# Altium project LightOnOff.PrjPcb
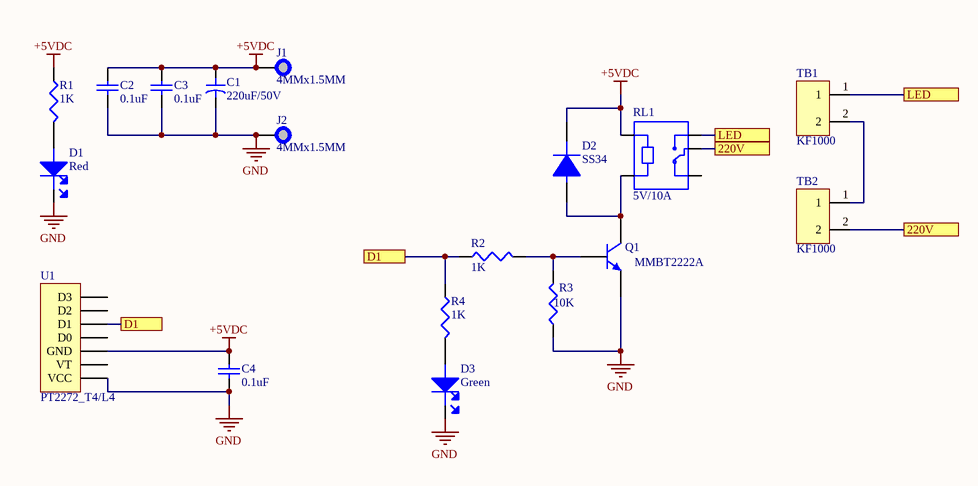
[diagram p0: LightOnOff.SchDoc]
1 sheet, 18 parts. Net scope: flat (ports and power ports of the same name join across sheets).
Board file: LightOnOff.PcbDoc

## Sheet LightOnOff.SchDoc
size A4

### Parts
C1  220uF/50V  [CAP_RADIAL_8MM]
C2  0.1uF  [C0805]
C3  0.1uF  [C0805]
C4  0.1uF  [C0805]
D1  Red  [LED_RED_0805]
D2  SS34  [DO14AC SMA]
D3  Green  [LED_GREEN_0805]
J1  4MMx1.5MM  [PAD_WITH_HOLE_4MMx1.5MM]  (no BOM)
J2  4MMx1.5MM  [PAD_WITH_HOLE_4MMx1.5MM]  (no BOM)
Q1  MMBT2222A  [SOT_23]
R1  1K  [R0805]
R2  1K  [R0805]
R3  10K  [R0805]
R4  1K  [R0805]
RL1  5V/10A  [Relay_SRD]
TB1  KF1000  [KF1000_2P]
TB2  KF1000  [KF1000_2P]
U1  PT2272_T4/L4  [PT2272_T4/L4]

### Ports
220V, D1, LED

### Nets
+5VDC: C1.1 C2.2 C3.2 C4.2 D2.2(Cathode) J1.1 R1.1 RL1.A1 U1.5(GND)
GND: C1.2 C2.1 C3.1 C4.1 D1.2(Cathode) D3.2(Cathode) J2.1 Q1.3(E) R3.1 U1.7(VCC)
NetD1_1: D1.1(Anode) R1.2
NetD2_1: D2.1(Anode) Q1.2(C) RL1.A2
NetD3_1: D3.1(Anode) R4.2
NetQ1_1: Q1.1(B) R2.2 R3.2
NetR2_1: R2.1 R4.1 U1.3(D1) ; port D1
NetRL1_COM: RL1.COM TB2.2 ; port 220V
NetRL1_NO: RL1.NO TB1.1 ; port LED
NetTB1_2: TB1.2 TB2.1

Not connected (* = marked no-connect by the designer): RL1 NC; U1 1(D3) 2(D2) 4(D0) 6(VT)

### Library data of the parts
C1 = C220uF_RADIAL_50V_8MM: ALUMINUM ELECTROLYTIC CAPACITOR, 220UF, 35V, 20%, RADIAL; Product Range:FM Series; Capacitance:220 F; Capacitance Tolerance: 20%; Voltage Rating:35V; Diameter:8mm; Capacitor Terminals:Radial Leaded; Packaging:Each; ESR:- ;RoHS Compliant: Yes; Manufacturer: Panasonic; Manufacturer Part Number: EEUFM1V221L; Dielectric Material: Aluminium; Ripple Current: 1.24A; Impedance: 41mR; Life (Hours): 3000Hour; Dissipation Factor: 0.12%; Lead Diameter: 0.6mm; Lead Length: 17mm; Supplier 1: Digi-Key; Stock 1: 22801; Pricing 1: 1=0.45000, 10=0.32100, 100=0.21170, 500=0.15680, 1000=0.13328, 2500=0.12544, 5000=0.11760 (USD); RoHS: Yes; Mount: Through Hole,PCB; Case/Package: Radial; Number of Pins: 2; Min Operating Temperature: -40°C; Max Operating Temperature: 105°C; Capacitance: 220uF; Tolerance: 20%; Termination: Radial; Packaging: Bulk; Package Quantity: 200; Voltage Rating (DC): 35V; Voltage Rating: 35V; ESR (Equivalent Series Resistance): 41mR; Voltage: 35V; Diameter: 8mm; Length: 15mm; Height: 15mm; Lead Pitch: 3.5mm; Height - Seated (Max): 0.65inch; Radiation Hardening: No; Lead Free: Lead Free; REACH SVHC: Yes; ComponentLink1URL: https://datasheet.ciiva.com/11782/0900766b805f3abe-11782034.pdf?src-supplier=RSComponents; ComponentLink1Description: https://datasheet.ciiva.com/11782/0900766b805f3abe-11782034.pdf?src-supplier=RSComponents; ComponentLink2URL: https://datasheet.ciiva.com/27052/1362169-27052083.pdf?src-supplier=Jameco; ComponentLink2Description: https://datasheet.ciiva.com/27052/1362169-27052083.pdf?src-supplier=Jameco; ComponentLink3URL: https://datasheet.ciiva.com/16432/aba0000ce108-16432952.pdf?src-supplier=Future+Electronics; ComponentLink3Description: https://datasheet.ciiva.com/16432/aba0000ce108-16432952.pdf?src-supplier=Future+Electronics; ComponentLink4URL: https://datasheet.ciiva.com/24025/a-e-461514-24025544.pdf?src-supplier=Mouser; ComponentLink4Description: https://datasheet.ciiva.com/24025/a-e-461514-24025544.pdf?src-supplier=Mouser; ComponentLink5URL: https://datasheet.ciiva.com/2984/aba0000ce108-2984074.pdf?src-supplier=Avnet; ComponentLink5Description: https://datasheet.ciiva.com/2984/aba0000ce108-2984074.pdf?src-supplier=Avnet; ComponentLink6URL: https://datasheet.ciiva.com/43454/1678946-43454650.pdf?src-supplier=Farnell; ComponentLink6Description: https://datasheet.ciiva.com/43454/1678946-43454650.pdf?src-supplier=Farnell; ComponentLink7URL: https://datasheet.ciiva.com/14594/70068540-14594187.pdf?src-supplier=Allied+Electronics; ComponentLink7Description: https://datasheet.ciiva.com/14594/70068540-14594187.pdf?src-supplier=Allied+Electronics; ComponentLink8URL: https://datasheet.ciiva.com/30085/aba0000ce108-30085595.pdf?src-supplier=Onlinecomponents.com; ComponentLink8Description: https://datasheet.ciiva.com/30085/aba0000ce108-30085595.pdf?src-supplier=Onlinecomponents.com; ComponentLink9URL: https://datasheet.ciiva.com/46396/1678946-46396779.pdf?src-supplier=Element14; ComponentLink9Description: https://datasheet.ciiva.com/46396/1678946-46396779.pdf?src-supplier=Element14; ComponentLink10URL: https://datasheet.ciiva.com/14586/70068540-14586860.pdf?src-supplier=Allied+Electronics; ComponentLink10Description: https://datasheet.ciiva.com/14586/70068540-14586860.pdf?src-supplier=Allied+Electronics; Supplier Part Number 1: P12412-ND
C2-C4 = C0.1uF_0805: KEMET         C0805C104Z5VACTU.             CERAMIC CAPACITOR, 0.1UF, 50V, Y5V, +80,-20%, 0805; Capacitance: 100nF; Tolerance: 80%; Dissipation Factor: 5%; Supplier 1: Digi-Key; Manufacturer: KEMET; Manufacturer Part Number: C0805C104Z5VACTU; Stock 1: 1249727; Pricing 1: 1 = 0.10000, 10 = 0.05700, 100 = 0.02540, 500 = 0.01818, 1000 = 0.01428 (USD); RoHS: Yes; Mount: Surface Mount,PCB; Case/Package: 0805; Number of Pins: 2; Case Code (Metric): 2012; Case Code (Imperial): 0805; Dielectric Material: Ceramic; Min Operating Temperature: -30°C; Max Operating Temperature: 85°C; Package Quantity: 1; Voltage Rating: 50V; Packaging: Tape and Reel; Voltage Rating (DC): 50V; Dielectric: Y5V; Termination: SMD/SMT; Voltage: 50V; Length: 2mm; Height: 0.9mm; Width: 0.049inch; Thickness: 0.039inch; Lead Pitch: 0.75mm; Depth: 1.25mm; Radiation Hardening: No; REACH SVHC: No SVHC; Lead Free: Lead Free; ComponentLink1URL: https://datasheet.ciiva.com/14597/70095383-14597846.pdf?src-supplier=Allied+Electronics; ComponentLink1Description: https://datasheet.ciiva.com/14597/70095383-14597846.pdf?src-supplier=Allied+Electronics; ComponentLink2URL: https://datasheet.ciiva.com/18219/getdatasheetpartid-37101-18219255.pdf?src-supplier=Verical; ComponentLink2Description: https://datasheet.ciiva.com/18219/getdatasheetpartid-37101-18219255.pdf?src-supplier=Verical; ComponentLink3URL: https://datasheet.ciiva.com/26847/getdatasheetpartid-321176-26847799.pdf?src-supplier=Verical; ComponentLink3Description: https://datasheet.ciiva.com/26847/getdatasheetpartid-321176-26847799.pdf?src-supplier=Verical; ComponentLink4URL: https://datasheet.ciiva.com/14608/70095383-14608251.pdf?src-supplier=Allied+Electronics; ComponentLink4Description: https://datasheet.ciiva.com/14608/70095383-14608251.pdf?src-supplier=Allied+Electronics; ComponentLink5URL: https://datasheet.ciiva.com/7842/1470417-7842543.pdf?src-supplier=Element14; ComponentLink5Description: https://datasheet.ciiva.com/7842/1470417-7842543.pdf?src-supplier=Element14; Supplier Part Number 1: 399-1177-1-ND
D1 = LED_RED_0805: LED RED DIFFUSED 0805 SMD; Manufacturer: Osram Opto; Manufacturer Part Number: LHR974-LP-1; Forward Voltage: 2.6V; Lens Style: Diffused,Colorless; Luminous Intensity: 15mcd; Viewing Angle: 160°; Forward Current: 30mA; Dominant Wavelength: 645nm; Number of Elements: 1; Test Current: 20mA; Reverse Voltage: 5V; Supplier 1: Digi-Key; Supplier Part Number 1: 475-1415-1-ND; Stock 1: 73137; Pricing 1: 1 = 0.27000, 10 = 0.20100, 100 = 0.09510, 500 = 0.06340, 1000 = 0.04966 (USD); RoHS: Yes; Mount: Surface Mount; Number of Pins: 2; Min Operating Temperature: -30°C; Max Operating Temperature: 85°C; Packaging: Tape and Reel; Length: 2.1mm; Depth: 1.35mm; Radiation Hardening: No; ComponentLink1URL: http://www.jameco.com/Jameco/Products/ProdDS/2085634.pdf?src-supplier=Jameco; ComponentLink1Description: http://www.jameco.com/Jameco/Products/ProdDS/2085634.pdf?src-supplier=Jameco; ComponentLink2URL: http://components.arrow.com/part/dataview/0323_01825492?src-supplier=Arrow+Europe; ComponentLink2Description: http://components.arrow.com/part/dataview/0323_01825492?src-supplier=Arrow+Europe; ComponentLink3URL: http://components.arrow.com/part/dataview/41971690S1077610N9133?src-supplier=Arrow; ComponentLink3Description: http://components.arrow.com/part/dataview/41971690S1077610N9133?src-supplier=Arrow; ComponentLink4URL: https://dammedia.osram.info/media/resource/hires/osram-dam-2493888/LH%20R974.pdf?src-supplier=Digi-Key; ComponentLink4Description: https://dammedia.osram.info/media/resource/hires/osram-dam-2493888/LH%20R974.pdf?src-supplier=Digi-Key; ComponentLink5URL: http://components.arrow.com/part/dataview/41971690S6190115N2128?src-supplier=Arrow; ComponentLink5Description: http://components.arrow.com/part/dataview/41971690S6190115N2128?src-supplier=Arrow; ComponentLink6URL: http://www.mouser.com/ds/2/311/LH%20R974%20-%20CHIPLED%200805-318659.pdf?src-supplier=Mouser; ComponentLink6Description: http://www.mouser.com/ds/2/311/LH%20R974%20-%20CHIPLED%200805-318659.pdf?src-supplier=Mouser; ComponentLink7URL: https://www.verical.com/server-webapp/html/getDatasheet?partID=258950&src-supplier=Verical; ComponentLink7Description: https://www.verical.com/server-webapp/html/getDatasheet?partID=258950&src-supplier=Verical
D2 = SS34_DO214AC
D3 = LED_GREEN_0805: Green 0805 130 º Min 5 mcd Typical 12 mcd Water Clear Lens SMT LED; Manufacturer: Vishay Lite-On; Manufacturer Part Number: LTST-C171GKT; Lens Color: Colorless; Viewing Angle: 130°; Lens Style: Diffused,Colorless,Rectangular,Clear; Luminous Intensity: 12mcd; Forward Current: 30mA; Forward Voltage: 2.1V; Power Rating: 100mW; Dominant Wavelength: 569nm; Test Current: 10mA; Number of Elements: 1; Wavelength: 585nm; Reverse Voltage: 5V; Supplier 1: Digi-Key; Supplier Part Number 1: 160-1423-1-ND; Stock 1: 284618; Pricing 1: 1 = 0.28000, 10 = 0.20100, 100 = 0.09540, 500 = 0.06364, 1000 = 0.04984 (USD); RoHS: Yes; Mount: Surface Mount; Case/Package: 0805; Number of Pins: 2; Color: Green; Case Code (Metric): 2012; Case Code (Imperial): 0805; Min Operating Temperature: -55°C; Max Operating Temperature: 85°C; Package Quantity: 1; Packaging: Tape and Reel; Illumination Color: Green; Lens Transparency: Clear; Power Dissipation: 100mW; Number of LEDs: 1; Length: 2mm; Height: 0.8mm; Width: 1.25mm; Depth: 1.25mm; Radiation Hardening: No; Lead Free: Lead Free; ComponentLink1URL: https://datasheet.ciiva.com/11773/0900766b80dc0296-11773991.pdf?src-supplier=RSComponents; ComponentLink1Description: https://datasheet.ciiva.com/11773/0900766b80dc0296-11773991.pdf?src-supplier=RSComponents; ComponentLink2URL: https://datasheet.ciiva.com/2110/ltst-c171gkt-2110000.pdf?src-supplier=Digi-Key; ComponentLink2Description: https://datasheet.ciiva.com/2110/ltst-c171gkt-2110000.pdf?src-supplier=Digi-Key; ComponentLink3URL: https://datasheet.ciiva.com/12400/lite-on-ltst-c171gkt-190133-12400647.pdf?src-supplier=Mouser; ComponentLink3Description: https://datasheet.ciiva.com/12400/lite-on-ltst-c171gkt-190133-12400647.pdf?src-supplier=Mouser; ComponentLink4URL: https://datasheet.ciiva.com/2110/ltst-c171gkt-2110001.pdf?src-supplier=Digi-Key; ComponentLink4Description: https://datasheet.ciiva.com/2110/ltst-c171gkt-2110001.pdf?src-supplier=Digi-Key; ComponentLink5URL: https://datasheet.ciiva.com/2110/ltst-c171gkt-2110002.pdf?src-supplier=Digi-Key; ComponentLink5Description: https://datasheet.ciiva.com/2110/ltst-c171gkt-2110002.pdf?src-supplier=Digi-Key; ComponentLink6URL: https://datasheet.ciiva.com/16396/ltst-c171gkt-16396549.pdf?src-supplier=Future+Electronics; ComponentLink6Description: https://datasheet.ciiva.com/16396/ltst-c171gkt-16396549.pdf?src-supplier=Future+Electronics
J1 J2 = PAD_WITH_HOLE_4MMx1.5MM: Pad with a hole 4mm x 1.5mm
Q1 = MMBT2222A: Transistors Bipolar - BJT SOT-23 NPN GEN PUR; Manufacture: Fairchild Semiconductor; BSH Part number: Q-MMBT2222A; Datasheet: http://www.mouser.com/ds/2/149/MMBT2222A-69200.pdf; Part number: MMBT2222A; Mouser add: http://vn.mouser.com/ProductDetail/Fairchild-Semiconductor/MMBT2222A/?qs=sGAEpiMZZMutXGli8Ay4kHKRdIvtrnJvbVzYv9px7so%3d
R1 R2 R4 = R1K_0805: RES SMD 1K OHM 1% 1/8W 0805; Manufacturer: Yageo; Manufacturer Part Number: RC0805FR-071KL; Resistance: 1kR; Temperature Coefficient: 100ppm/°C; Voltage Rating (DC): 150V; Power Rating: 125mW; Supplier 1: Digi-Key; Stock 1: 26292297; Pricing 1: 1 = 0.10000, 10 = 0.03600, 100 = 0.01480, 1000 = 0.00663, 2500 = 0.00575 (USD); RoHS: Yes; Case/Package: 0805; Number of Pins: 2; Case Code (Metric): 2012; Case Code (Imperial): 0805; Min Operating Temperature: -55°C; Max Operating Temperature: 155°C; Tolerance: 1%; Packaging: Tape and Reel; Composition: Thick Film; Package Quantity: 1; Voltage Rating: 150V; Number of Terminations: 2; Termination: SMD/SMT; Military Standard: Not; Max Power Dissipation: 125mW; Features: Moisture Resistant; Length: 0.079inch; Height: 0.024inch; Width: 0.049inch; Depth: 1.25mm; REACH SVHC: Unknown; Lead Free: Lead Free; ComponentLink1URL: https://datasheet.ciiva.com/2456/pyu-r-int-thick-7-2456976.pdf?src-supplier=Digi-Key; ComponentLink1Description: https://datasheet.ciiva.com/2456/pyu-r-int-thick-7-2456976.pdf?src-supplier=Digi-Key; ComponentLink2URL: https://datasheet.ciiva.com/2456/pyu-r-int-thick-7-2456977.pdf?src-supplier=Digi-Key; ComponentLink2Description: https://datasheet.ciiva.com/2456/pyu-r-int-thick-7-2456977.pdf?src-supplier=Digi-Key; ComponentLink3URL: https://datasheet.ciiva.com/7941/1686128-7941719.pdf?src-supplier=Element14; ComponentLink3Description: https://datasheet.ciiva.com/7941/1686128-7941719.pdf?src-supplier=Element14; ComponentLink4URL: https://datasheet.ciiva.com/16850/rc0805-16850409.pdf?src-supplier=Future+Electronics; ComponentLink4Description: https://datasheet.ciiva.com/16850/rc0805-16850409.pdf?src-supplier=Future+Electronics; ComponentLink5URL: https://datasheet.ciiva.com/46385/444164-46385020.pdf?src-supplier=Element14; ComponentLink5Description: https://datasheet.ciiva.com/46385/444164-46385020.pdf?src-supplier=Element14; ComponentLink6URL: https://datasheet.ciiva.com/2456/pyu-r-int-thick-7-2456975.pdf?src-supplier=Digi-Key; ComponentLink6Description: https://datasheet.ciiva.com/2456/pyu-r-int-thick-7-2456975.pdf?src-supplier=Digi-Key; Supplier Part Number 1: 311-1.00KCRCT-ND
R3 = R10K_0805: RES SMD 10K OHM 1% 1/8W 0805; Manufacturer: Yageo; Manufacturer Part Number: RC0805FR-0710KL; Resistance: 10kR; Temperature Coefficient: 100ppm/°C; Power Rating: 125mW; Voltage Rating: 150V; Supplier 1: Digi-Key; Supplier Part Number 1: 311-10.0KCRCT-ND; Stock 1: 37831014; Pricing 1: 1 = 0.10000, 10 = 0.03600, 100 = 0.01450, 1000 = 0.00652, 2500 = 0.00566 (USD); RoHS: Yes; Case/Package: 0805; Case Code (Imperial): 0805; Case Code (Metric): 2012; Min Operating Temperature: -55°C; Max Operating Temperature: 155°C; Tolerance: 1%; Composition: Thick Film; Packaging: Tape and Reel; Package Quantity: 1; Termination: SMD/SMT; Number of Terminations: 2; Military Standard: Not; Max Power Dissipation: 125mW; Features: Moisture Resistant; Length: 2mm; Height: 0.024inch; Width: 0.049inch; Depth: 1.25mm; REACH SVHC: Unknown; Lead Free: Lead Free; ComponentLink1URL: https://datasheet.ciiva.com/11808/0900766b8106beab-11808151.pdf?src-supplier=RSComponents; ComponentLink1Description: https://datasheet.ciiva.com/11808/0900766b8106beab-11808151.pdf?src-supplier=RSComponents; ComponentLink2URL: https://datasheet.ciiva.com/12669/rc0805-12669688.pdf?src-supplier=Mouser; ComponentLink2Description: https://datasheet.ciiva.com/12669/rc0805-12669688.pdf?src-supplier=Mouser; ComponentLink3URL: https://datasheet.ciiva.com/46447/444164-46447563.pdf?src-supplier=Element14; ComponentLink3Description: https://datasheet.ciiva.com/46447/444164-46447563.pdf?src-supplier=Element14; ComponentLink4URL: https://datasheet.ciiva.com/2456/pyu-r-int-thick-7-2456972.pdf?src-supplier=Digi-Key; ComponentLink4Description: https://datasheet.ciiva.com/2456/pyu-r-int-thick-7-2456972.pdf?src-supplier=Digi-Key; ComponentLink5URL: https://datasheet.ciiva.com/2456/pyu-r-int-thick-7-2456973.pdf?src-supplier=Digi-Key; ComponentLink5Description: https://datasheet.ciiva.com/2456/pyu-r-int-thick-7-2456973.pdf?src-supplier=Digi-Key; ComponentLink6URL: https://datasheet.ciiva.com/2456/pyu-r-int-thick-7-2456974.pdf?src-supplier=Digi-Key; ComponentLink6Description: https://datasheet.ciiva.com/2456/pyu-r-int-thick-7-2456974.pdf?src-supplier=Digi-Key; ComponentLink7URL: https://datasheet.ciiva.com/16747/rc0805-16747087.pdf?src-supplier=Future+Electronics; ComponentLink7Description: https://datasheet.ciiva.com/16747/rc0805-16747087.pdf?src-supplier=Future+Electronics
RL1 = Relay_SRD_5VDC
TB1 TB2 = KF1000_2P
U1 = PT2272_Module_T4/L4